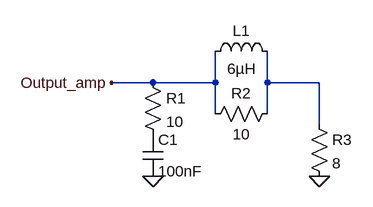
[diagram p0: schematic output_compensation.asc]
output_compensation.asc, the LTspice schematic file:
Version 4
SHEET 1 880 680
WIRE 176 112 112 112
WIRE 272 112 272 64
WIRE 272 112 176 112
WIRE 352 112 352 64
WIRE 432 112 352 112
WIRE 272 160 272 112
WIRE 352 160 352 112
WIRE 432 176 432 112
FLAG 176 256 0
FLAG 432 256 0
FLAG 112 112 Output_amp
SYMBOL res 160 96 R0
SYMATTR InstName R1
SYMATTR Value 10
SYMBOL cap 160 192 R0
SYMATTR InstName C1
SYMATTR Value 100nF
SYMBOL ind 256 80 R270
WINDOW 0 32 56 VTop 2
WINDOW 3 5 56 VBottom 2
SYMATTR InstName L1
SYMATTR Value 6µH
SYMBOL res 368 144 R90
WINDOW 0 0 56 VBottom 2
WINDOW 3 32 56 VTop 2
SYMATTR InstName R2
SYMATTR Value 10
SYMBOL res 416 160 R0
SYMATTR InstName R3
SYMATTR Value 8

The netlist it stands for:
* output_compensation.asc
R1 Output_amp P001 10
C1 P001 0 100nF
L1 Output_amp N001 6µH
R2 N001 Output_amp 10
R3 N001 0 8
.backanno
.end